# Altium schematic sheet Cameras.SchDoc
size B; DocumentNumber: 9; SheetNumber: 9
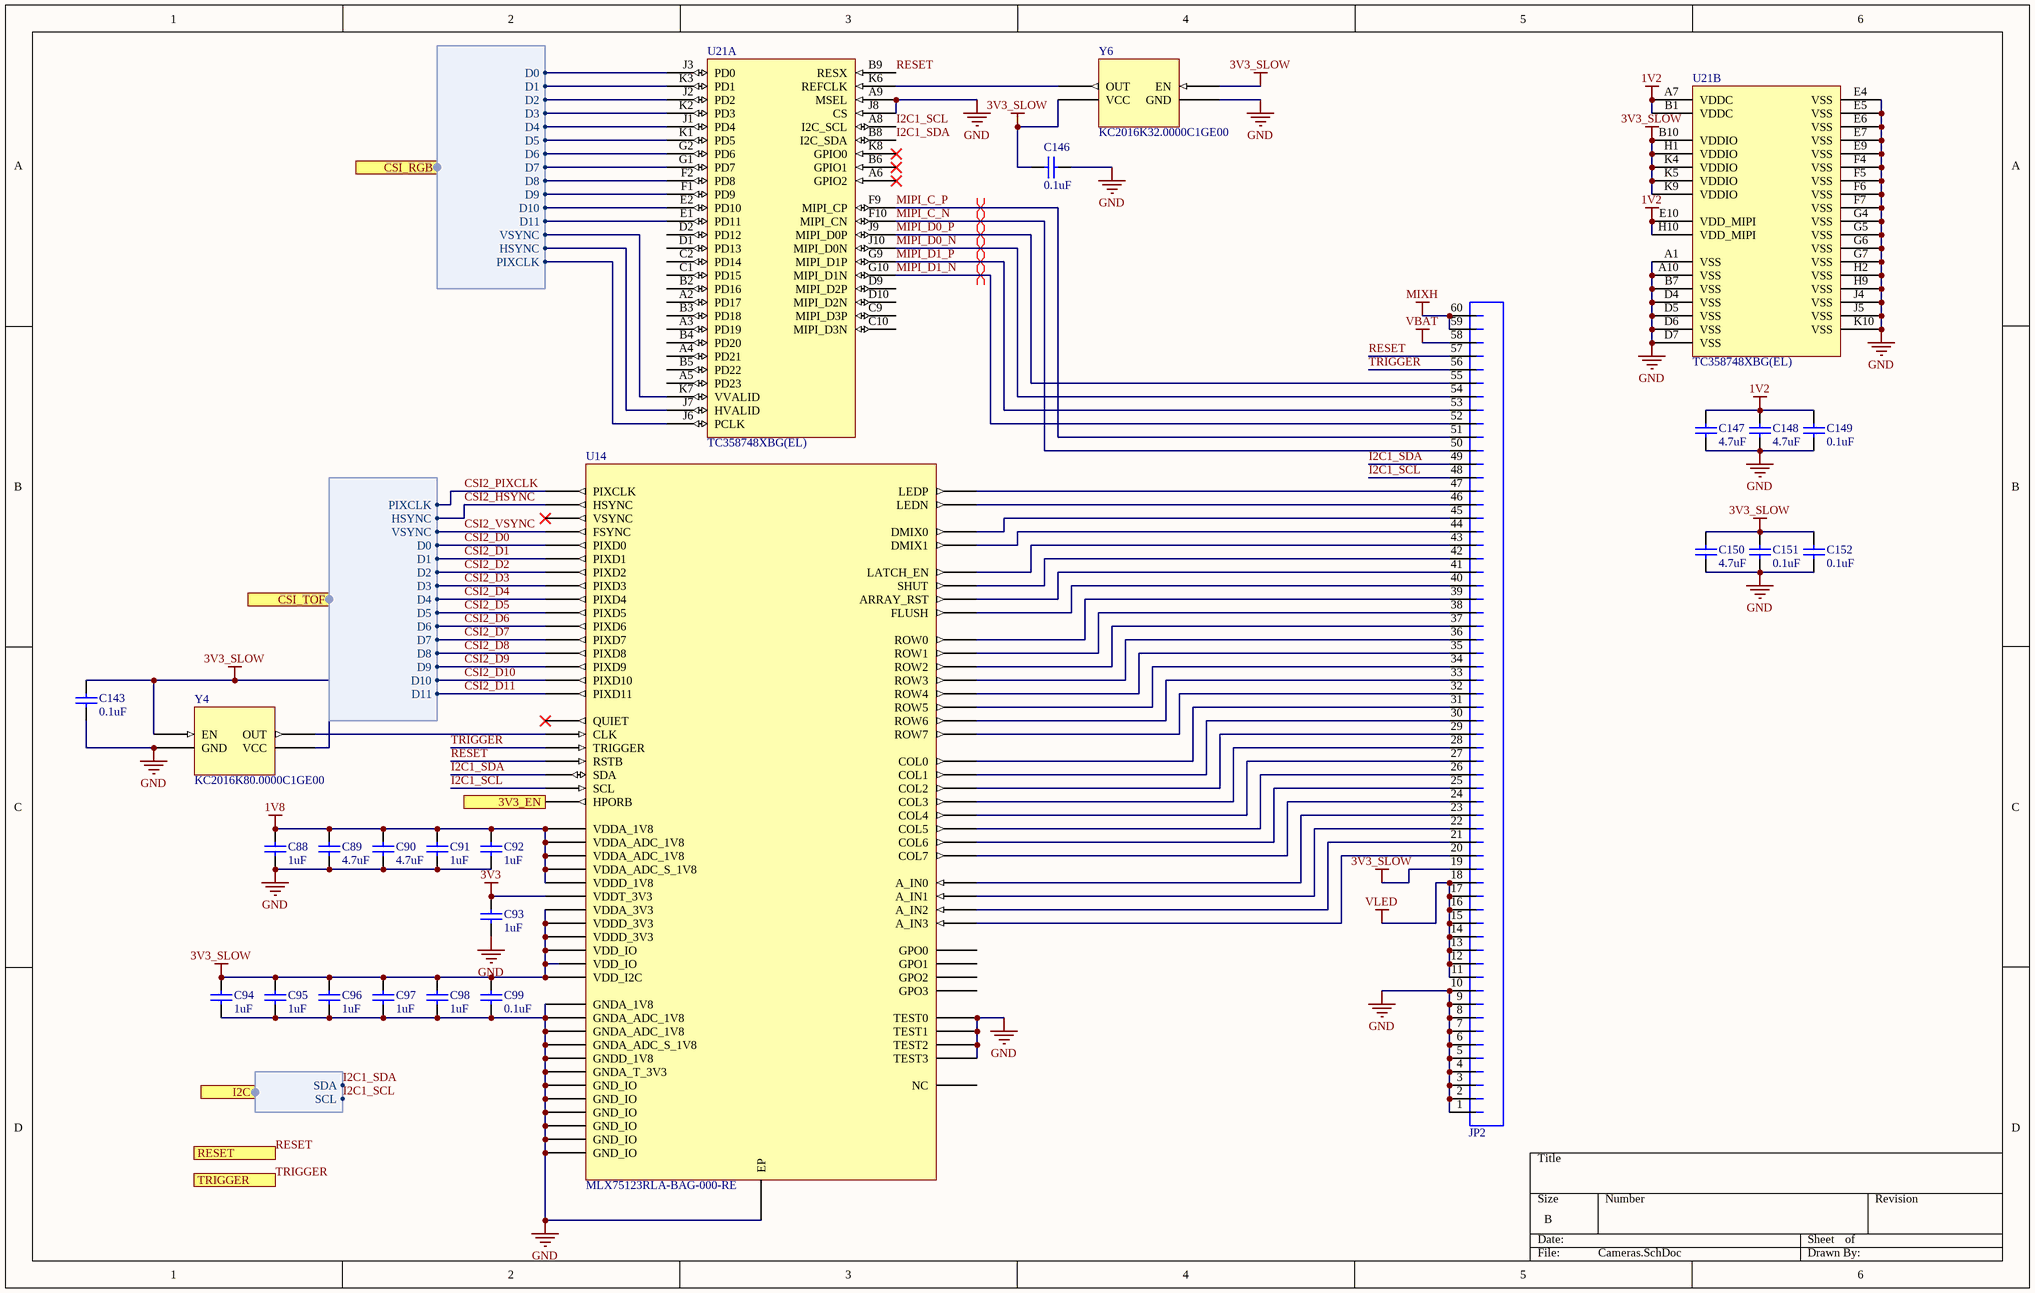
[diagram p0: Cameras.SchDoc]

## Parts
C88  value 1uF  [C0402[1005X55]]  (hidden comment: 1uF 6.3V 0402)
C89  value 4.7uF  [C0402[1005X55]]  (hidden comment: 4.7uF 6.3V 0402)
C90  value 4.7uF  [C0402[1005X55]]  (hidden comment: 4.7uF 6.3V 0402)
C91  value 1uF  [C0402[1005X55]]  (hidden comment: 1uF 6.3V 0402)
C92  value 1uF  [C0402[1005X55]]  (hidden comment: 1uF 6.3V 0402)
C93  value 1uF  [C0402[1005X55]]  (hidden comment: 1uF 6.3V 0402)
C94  value 1uF  [C0402[1005X55]]  (hidden comment: 1uF 6.3V 0402)
C95  value 1uF  [C0402[1005X55]]  (hidden comment: 1uF 6.3V 0402)
C96  value 1uF  [C0402[1005X55]]  (hidden comment: 1uF 6.3V 0402)
C97  value 1uF  [C0402[1005X55]]  (hidden comment: 1uF 6.3V 0402)
C98  value 1uF  [C0402[1005X55]]  (hidden comment: 1uF 6.3V 0402)
C99  value 0.1uF  [C0402[1005X55]]  (hidden comment: 0.1uF 6.3V 0402)
C143  value 0.1uF  [C0402[1005X55]]  (hidden comment: 0.1uF 6.3V 0402)
C146  value 0.1uF  [C0402[1005X55]]  (hidden comment: 0.1uF 6.3V 0402)
C147  value 4.7uF  [C0402[1005X55]]  (hidden comment: 4.7uF 6.3V 0402)
C148  value 4.7uF  [C0402[1005X55]]  (hidden comment: 4.7uF 6.3V 0402)
C149  value 0.1uF  [C0402[1005X55]]  (hidden comment: 0.1uF 6.3V 0402)
C150  value 4.7uF  [C0402[1005X55]]  (hidden comment: 4.7uF 6.3V 0402)
C151  value 0.1uF  [C0402[1005X55]]  (hidden comment: 0.1uF 6.3V 0402)
C152  value 0.1uF  [C0402[1005X55]]  (hidden comment: 0.1uF 6.3V 0402)
JP2  JST_JMD_60_HORZ  [JST-JMD-60-SMD-HORZ]  (value not drawn)
U14  MLX75123RLA-BAG-000-RE  [AQFN-84]
U21  TC358748XBG(EL)  [BGA-80]  (parts A,B of 2)
Y4  KC2016K80.0000C1GE00  [KC2016K]
Y6  KC2016K32.0000C1GE00  [KC2016K]

## Ports
3V3_EN (out), CSI_RGB (harness CSI12), CSI_TOF (harness CSI12), I2C (harness I2C), RESET (in), TRIGGER (in)

## Harnesses
CSI12: D2, D3, D1, D0, D6, D7, D5, D4, D10, D9, D8, PIXCLK, D11, HSYNC, VSYNC
I2C: SCL, SDA

## Nets
1V2: C147.2 C148.2 C149.2 U21.A7(VDDC) U21.B1(VDDC) U21.E10(VDD_MIPI) U21.H10(VDD_MIPI)
1V8: C88.2 C89.2 C90.2 C91.2 C92.2 U14.A9(VDDA_ADC_1V8) U14.A10(VDDA_ADC_S_1V8) U14.B5(VDDA_ADC_1V8) U14.B14(VDDA_1V8) U14.B20(VDDD_1V8)
3V3: C93.2 U14.B17(VDDT_3V3)
3V3_SLOW: C94.2 C95.2 C96.2 C97.2 C98.2 C99.2 C143.2 C146.1 C150.2 C151.2 C152.2 JP2.19 U14.A36(VDDD_3V3) U14.B4(VDDA_3V3) U14.B12(VDD_I2C) U14.B21(VDD_IO) U14.B30(VDD_IO) U14.B38(VDDD_3V3) U21.B10(VDDIO) U21.H1(VDDIO) U21.K4(VDDIO) U21.K5(VDDIO) U21.K9(VDDIO) Y4.1(EN) Y4.4(VCC) Y6.1(EN) Y6.4(VCC)
GND: C88.1 C89.1 C90.1 C91.1 C92.1 C93.1 C94.1 C95.1 C96.1 C97.1 C98.1 C99.1 C143.1 C146.2 C147.1 C148.1 C149.1 C150.1 C151.1 C152.1 JP2.1 JP2.2 JP2.3 JP2.4 JP2.5 JP2.6 JP2.7 JP2.8 JP2.9 JP2.10 U14.A5(GNDA_ADC_1V8) U14.A8(GND_IO) U14.A11(TEST2) U14.A16(GNDA_1V8) U14.A17(TEST0) U14.A18(GNDA_T_3V3) U14.A22(GNDD_1V8) U14.A24(GND_IO) U14.A33(GND_IO) U14.A41(GND_IO) U14.B8(GNDA_ADC_1V8) U14.B9(GNDA_ADC_S_1V8) U14.B10(TEST3) U14.B15(GND_IO) U14.B16(TEST1) U14.B33(GND_IO) U14.EP U21.A1(VSS) U21.A9(MSEL) U21.A10(VSS) U21.B7(VSS) U21.D4(VSS) U21.D5(VSS) U21.D6(VSS) U21.D7(VSS) U21.E4(VSS) U21.E5(VSS) U21.E6(VSS) U21.E7(VSS) U21.E9(VSS) U21.F4(VSS) U21.F5(VSS) U21.F6(VSS) U21.F7(VSS) U21.G4(VSS) U21.G5(VSS) U21.G6(VSS) U21.G7(VSS) U21.H2(VSS) U21.H9(VSS) U21.J4(VSS) U21.J5(VSS) U21.J8(CS) U21.K10(VSS) Y4.2(GND) Y6.2(GND)
MIXH: JP2.59 JP2.60
VBAT: JP2.58
VLED: JP2.11 JP2.12 JP2.13 JP2.14 JP2.15 JP2.16 JP2.17 JP2.18
3V3_EN: U14.A19(HPORB) ; port 3V3_EN
CSI2_D0: U14.A30(PIXD0) ; port CSI_TOF.D0
CSI2_D1: U14.B27(PIXD1) ; port CSI_TOF.D1
CSI2_D2: U14.A29(PIXD2) ; port CSI_TOF.D2
CSI2_D3: U14.B26(PIXD3) ; port CSI_TOF.D3
CSI2_D4: U14.A28(PIXD4) ; port CSI_TOF.D4
CSI2_D5: U14.B25(PIXD5) ; port CSI_TOF.D5
CSI2_D6: U14.A27(PIXD6) ; port CSI_TOF.D6
CSI2_D7: U14.B24(PIXD7) ; port CSI_TOF.D7
CSI2_D8: U14.A26(PIXD8) ; port CSI_TOF.D8
CSI2_D9: U14.B23(PIXD9) ; port CSI_TOF.D9
CSI2_D10: U14.A25(PIXD10) ; port CSI_TOF.D10
CSI2_D11: U14.B22(PIXD11) ; port CSI_TOF.D11
CSI2_HSYNC: U14.B29(HSYNC) ; port CSI_TOF.HSYNC
CSI2_PIXCLK: U14.B28(PIXCLK) ; port CSI_TOF.PIXCLK
CSI2_VSYNC: U14.A31(FSYNC) ; port CSI_TOF.VSYNC
I2C1_SCL: JP2.48 U14.A12(SCL) U21.A8(I2C_SCL) ; port I2C.SCL
I2C1_SDA: JP2.49 U14.B11(SDA) U21.B8(I2C_SDA) ; port I2C.SDA
MIPI_C_N: JP2.50 U21.F10(MIPI_CN)
MIPI_C_P: JP2.51 U21.F9(MIPI_CP)
MIPI_D0_N: JP2.54 U21.J10(MIPI_D0N)
MIPI_D0_P: JP2.55 U21.J9(MIPI_D0P)
MIPI_D1_N: JP2.52 U21.G10(MIPI_D1N)
MIPI_D1_P: JP2.53 U21.G9(MIPI_D1P)
RESET: JP2.57 U14.A14(RSTB) U21.B9(RESX) ; port RESET
TRIGGER: JP2.56 U14.A13(TRIGGER) ; port TRIGGER
NetJP2_20: JP2.20 U14.B7(A_IN3)
NetJP2_21: JP2.21 U14.A7(A_IN2)
NetJP2_22: JP2.22 U14.A6(A_IN1)
NetJP2_23: JP2.23 U14.B6(A_IN0)
NetJP2_24: JP2.24 U14.A37(COL7)
NetJP2_25: JP2.25 U14.B34(COL6)
NetJP2_26: JP2.26 U14.A38(COL5)
NetJP2_27: JP2.27 U14.B35(COL4)
NetJP2_28: JP2.28 U14.A39(COL3)
NetJP2_29: JP2.29 U14.B36(COL2)
NetJP2_30: JP2.30 U14.A40(COL1)
NetJP2_31: JP2.31 U14.B37(COL0)
NetJP2_32: JP2.32 U14.A2(ROW7)
NetJP2_33: JP2.33 U14.B1(ROW6)
NetJP2_34: JP2.34 U14.A1(ROW5)
NetJP2_35: JP2.35 U14.A44(ROW4)
NetJP2_36: JP2.36 U14.B40(ROW3)
NetJP2_37: JP2.37 U14.A43(ROW2)
NetJP2_38: JP2.38 U14.B39(ROW1)
NetJP2_39: JP2.39 U14.A42(ROW0)
NetJP2_40: JP2.40 U14.B3(FLUSH)
NetJP2_41: JP2.41 U14.A3(ARRAY_RST)
NetJP2_42: JP2.42 U14.B2(SHUT)
NetJP2_43: JP2.43 U14.A4(LATCH_EN)
NetJP2_44: JP2.44 U14.B32(DMIX1)
NetJP2_45: JP2.45 U14.A35(DMIX0)
NetJP2_46: JP2.46 U14.A34(LEDN)
NetJP2_47: JP2.47 U14.B31(LEDP)
NetU14_B13: U14.B13(CLK) Y4.3(OUT)
NetU21_E1: U21.E1(PD11) ; port CSI_RGB.D11
NetU21_E2: U21.E2(PD10) ; port CSI_RGB.D10
NetU21_F1: U21.F1(PD9) ; port CSI_RGB.D9
NetU21_F2: U21.F2(PD8) ; port CSI_RGB.D8
NetU21_G1: U21.G1(PD7) ; port CSI_RGB.D7
NetU21_G2: U21.G2(PD6) ; port CSI_RGB.D6
NetU21_J1: U21.J1(PD4) ; port CSI_RGB.D4
NetU21_J2: U21.J2(PD2) ; port CSI_RGB.D2
NetU21_J3: U21.J3(PD0) ; port CSI_RGB.D0
NetU21_J6: U21.J6(PCLK) ; port CSI_RGB.PIXCLK
NetU21_J7: U21.J7(HVALID) ; port CSI_RGB.HSYNC
NetU21_K1: U21.K1(PD5) ; port CSI_RGB.D5
NetU21_K2: U21.K2(PD3) ; port CSI_RGB.D3
NetU21_K3: U21.K3(PD1) ; port CSI_RGB.D1
NetU21_K6: U21.K6(REFCLK) Y6.3(OUT)
NetU21_K7: U21.K7(VVALID) ; port CSI_RGB.VSYNC

Not connected (* = marked no-connect by the designer): U14 A15(QUIET)* A20(GPO1) A21(GPO3) A23(NC) A32(VSYNC)* B18(GPO0) B19(GPO2); U21 A2(PD17) A3(PD19) A4(PD21) A5(PD23) A6(GPIO2)* B2(PD16) B3(PD18) B4(PD20) B5(PD22) B6(GPIO1)* C1(PD15) C2(PD14) C9(MIPI_D3P) C10(MIPI_D3N) D1(PD13) D2(PD12) D9(MIPI_D2P) D10(MIPI_D2N) K8(GPIO0)*

## Layout directives
differential pair; differential pair class USB2: MIPI_C_N, MIPI_C_P, MIPI_D0_N, MIPI_D0_P, MIPI_D1_N, MIPI_D1_P

## Library data of the parts
C88 C91-C98 = CAP_1uF_6.3V_0402_10%: 1uF 6.3V 10% 0402 (1005 Metric); PartNumber: GRM155R70J105KA12D; Manufacturer: Murata; Mounting Technology: Surface Mount; PackageReference: 0402; PackageDescription: 0402 (1005 Metric); Voltage: 6.3V; Tolerance: 10%
C89 C90 C147 C148 C150 = CAP_4.7uF_6.3V_0402_20%: 4.7uF 6.3V 20% 0402 (1005 Metric); PartNumber: GRM155R60J475ME47D; Manufacturer: Murata; Mounting Technology: Surface Mount; PackageReference: 0402; PackageDescription: 0402 (1005 Metric); Voltage: 6.3V; Tolerance: 20%
C99 C143 C146 C149 C151 C152 = CAP_0.1uF_6.3V_0402_10%: 0.1uF 6.3V 10% 0402 (1005 Metric); PartNumber: GRM155R70J104KA01D; Manufacturer: Murata; Mounting Technology: Surface Mount; PackageReference: 0402; PackageDescription: 0402 (1005 Metric); Voltage: 6.3V; Tolerance: 10%
JP2 = JST_JMD_60_HORZ: Manufacturer: JST Sales America, Inc.; PartNumber: 60PS-JMDSS-G-1-TF; PackageReference: JMD-60; Mounting Technology: Surface Mount
U14 = MLX75123RLA-BAG-000-RE: Sensor Interface ToF Companion Chip; Manufacturer: Melexis; PackageReference: AQFN-84; Mounting Technology: Surface Mount; PartNumber: MLX75123RLA-BAG-000-RE
U21 = TC358748XBG(EL): IC MIPI CSI2 TO PARALLEL 80VFBGA; Manufacturer: Toshiba Semiconductor; PartNumber: TC358748XBG(EL); Mounting Technology: Surface Mount; PackageReference: BGA-80
Y4 = KC2016K80.0000C1GE00: OSC XO 80.0000MHZ CMOS SMD; Manufacturer: AVX; PartNumber: KC2016K80.0000C1GE00; Mounting Technology: Surface Mount; PackageReference: SMD-4
Y6 = KC2016K32.0000C1GE00: OSC XO 32.0000MHZ CMOS SMD; Manufacturer: Kyocera; PartNumber: KC2016K32.0000C1GE00; Mounting Technology: Surface Mount; PackageReference: SMD-4